# EAGLE design Thermistor_readout (EAGLE 7.7.0)
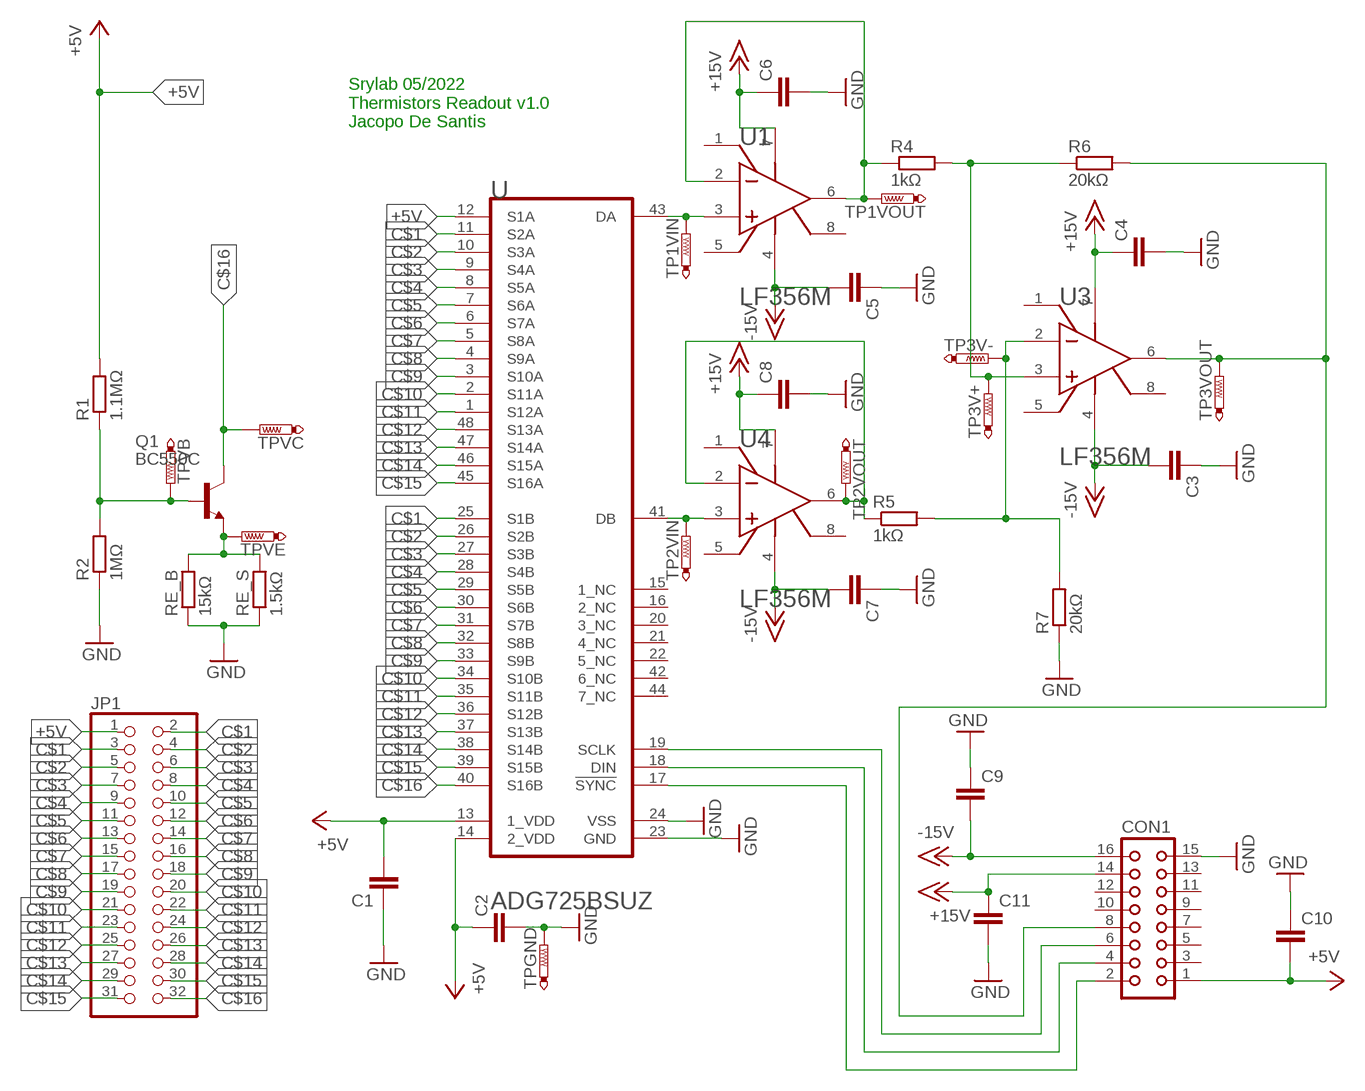
[diagram p0: schematic, sheet 1]

## Parts
C1  C-EU_SMDR1206H  [R1206H]
C2  C-EU_SMDR1206H  [R1206H]
C3  C-EU_SMDR1206H  [R1206H]
C4  C-EU_SMDR1206H  [R1206H]
C5  C-EU_SMDR1206H  [R1206H]
C6  C-EU_SMDR1206H  [R1206H]
C7  C-EU_SMDR1206H  [R1206H]
C8  C-EU_SMDR1206H  [R1206H]
C9  C-EU_SMDC1206H/D  [C1206H/D]
C10  C-EU_SMDC1206H/D  [C1206H/D]
C11  C-EU_SMDC1206H/D  [C1206H/D]
CON1  CON16L  [CON16L]
JP1  PINHD-2X16  [2X16]
Q1  BC550C  [TO92-EBC]
R1  1.1ΜΩ  R-EU_SMD0805H  [R0805H]
R2  1ΜΩ  R-EU_SMD0805H  [R0805H]
R4  1kΩ  R-EU_SMD0805H  [R0805H]
R5  1kΩ  R-EU_SMD0805H  [R0805H]
R6  20kΩ  R-EU_SMD0805H  [R0805H]
R7  20kΩ  R-EU_SMD0805H  [R0805H]
RE_B  15kΩ  R-EU_SMD1206H  [R1206H]
RE_S  1.5kΩ  R-EU_SMD0805H  [R0805H]
TP1VIN  PTR1TP20R  [TP20R]
TP1VOUT  PTR1TP20R  [TP20R]
TP2VIN  PTR1TP20R  [TP20R]
TP2VOUT  PTR1TP20R  [TP20R]
TP3V+  PTR1TP20R  [TP20R]
TP3V-  PTR1TP20R  [TP20R]
TP3VOUT  PTR1TP20R  [TP20R]
TPGND  PTR1TP20R  [TP20R]
TPVB  PTR1TP20R  [TP20R]
TPVC  PTR1TP20R  [TP20R]
TPVE  PTR1TP20R  [TP20R]
U  ANALOG_DEVICES_ADG725BSUZANALOG_DEVICES_ADG725BSUZ_0_2  [ANALOG_DEVICES_ADG725BSUZ_2]
U1  TI_NATIONAL_SEMICONDUCTOR_LF356MTI_NATIONAL_SEMICONDUCTOR_LF356M_0_2  [TI_NATIONAL_SEMICONDUCTOR_LF356M_2]
U3  TI_NATIONAL_SEMICONDUCTOR_LF356MTI_NATIONAL_SEMICONDUCTOR_LF356M_0_2  [TI_NATIONAL_SEMICONDUCTOR_LF356M_2]
U4  TI_NATIONAL_SEMICONDUCTOR_LF356MTI_NATIONAL_SEMICONDUCTOR_LF356M_0_2  [TI_NATIONAL_SEMICONDUCTOR_LF356M_2]

## Nets
+5V: C1.2 C2.1 C10.2 CON1.1 JP1.1 R1.2 U.12(S1A) U.13(1_VDD) U.14(2_VDD)
+15V: C4.1 C6.1 C8.1 C11.1 CON1.14 U1.7(V+) U3.7(V+) U4.7(V+)
-15V: C3.2 C5.2 C7.2 C9.2 CON1.16 U1.4(V-) U3.4(V-) U4.4(V-)
C$1: JP1.2 JP1.3 U.11(S2A) U.25(S1B)
C$2: JP1.4 JP1.5 U.10(S3A) U.26(S2B)
C$3: JP1.6 JP1.7 U.9(S4A) U.27(S3B)
C$4: JP1.8 JP1.9 U.8(S5A) U.28(S4B)
C$5: JP1.10 JP1.11 U.7(S6A) U.29(S5B)
C$6: JP1.12 JP1.13 U.6(S7A) U.30(S6B)
C$7: JP1.14 JP1.15 U.5(S8A) U.31(S7B)
C$8: JP1.16 JP1.17 U.4(S9A) U.32(S8B)
C$9: JP1.18 JP1.19 U.3(S10A) U.33(S9B)
C$10: JP1.20 JP1.21 U.2(S11A) U.34(S10B)
C$11: JP1.22 JP1.23 U.1(S12A) U.35(S11B)
C$12: JP1.24 JP1.25 U.36(S12B) U.48(S13A)
C$13: JP1.26 JP1.27 U.37(S13B) U.47(S14A)
C$14: JP1.28 JP1.29 U.38(S14B) U.46(S15A)
C$15: JP1.30 JP1.31 U.39(S15B) U.45(S16A)
C$16: JP1.32 Q1.C TPVC.TP U.40(S16B)
GND: C1.1 C2.2 C3.1 C4.2 C5.1 C6.2 C7.1 C8.2 C9.1 C10.1 C11.2 CON1.15 R2.1 R7.1 RE_B.1 RE_S.1 TPGND.TP U.23(GND) U.24(VSS)
N$1: Q1.B R1.1 R2.2 TPVB.TP
N$2: Q1.E RE_B.2 RE_S.2 TPVE.TP
N$3: TP2VIN.TP U4.3(IN+) U.41(DB)
N$4: R4.1 TP1VOUT.TP U1.2(IN-) U1.6(OUT)
N$5: R5.2 R7.2 TP3V-.TP U3.2(IN-)
N$6: R4.2 R6.1 TP3V+.TP U3.3(IN+)
N$7: TP1VIN.TP U1.3(IN+) U.43(DA)
N$8: R5.1 TP2VOUT.TP U4.2(IN-) U4.6(OUT)
N$11: CON1.6 U.19(SCLK)
N$13: CON1.2 U.17(!SYNC!)
N$14: CON1.4 U.18(DIN)
N$24: CON1.8 R6.2 TP3VOUT.TP U3.6(OUT)
Unconnected: CON1.3 CON1.5 CON1.7 CON1.9 CON1.10 CON1.11 CON1.12 CON1.13 U1.1(1_BAL) U1.5(2_BAL) U1.8(NC) U3.1(1_BAL) U3.5(2_BAL) U3.8(NC) U4.1(1_BAL) U4.5(2_BAL) U4.8(NC) U.15(1_NC) U.16(2_NC) U.20(3_NC) U.21(4_NC) U.22(5_NC) U.42(6_NC) U.44(7_NC)

## Notes on the sheet
- Srylab 05/2022
  Thermistors Readout v1.0
  Jacopo De Santis

## Library data of the parts
C1-C11 = 1AKarstenLib:C-EU_SMD: Capacitor, SMD only European Symbol Copied/Created July 2012 by K.F. Changed September 2016 by K.F.
CON1 = con-harting:CON16L: CONNECTOR; OC_FARNELL: unknown; OC_NEWARK: unknown
JP1 = pinhead:PINHD-2X16: PIN HEADER
Q1 = transistor-npn:BC550*: NPN Transistor
R1 R2 R4-R7 RE_B RE_S = 1AKarstenLib:R-EU_SMD: Resistor, SMD only European Symbol Copied/Created July 2012 by K.F.
TP1VIN TP1VOUT TP2VIN TP2VOUT TP3V+ TP3V- TP3VOUT TPGND TPVB TPVC TPVE = testpad:PTR1: TEST PIN
U = Analog Devices - ADG725BSUZ:ANALOG_DEVICES_ADG725BSUZ: ADI-ADG725-SU-48; BANDWIDTH_HZ: 34M; CIIVA_IDS: 987218; CODE__JEDEC: MS-026ABC; COMPONENT_LINK_1_DESCRIPTION: Manufacturer URL; COMPONENT_LINK_1_URL: http://www.analog.com/en/index.html; COMPONENT_LINK_3_DESCRIPTION: Package Specification; COMPONENT_LINK_3_URL: http://www.analog.com/static/imported-files/packages/470644706845302410119987SU48_7x7.pdf; DATASHEET: http://www.analog.com/static/imported-files/data_sheets/ADG725_731.pdf; DATASHEET_VERSION: Rev. A; FOOTPRINT_VARIANT_NAME_0: Level C; FOOTPRINT_VARIANT_NAME_1: Level B; FOOTPRINT_VARIANT_NAME_2: Level A; IMPORTED: yes; IMPORTED_FROM: vault; IMPORT_TS: 1521844804; MAX_ANALOG_SIGNAL_RANGE: Vss to Vdd; MF: Analog Devices; MOUNTING_TECHNOLOGY: Surface Mount; MPN: ADG725BSUZ; PACKAGE: SU-48; PACKAGE_DESCRIPTION: 48-Pin Thin Plastic Quad Flat Package, Body 7 x 7 mm, Pitch 0.5 mm; PACKING: Tray; PIN_0_0_18_INSIDE_EDGE: clock; PREFIX: U; RELEASE_DATE: 1391107388; RON_OHMS: 4; SUPPLY_V_GUAR_PERFORMANCE: Dual_(+/-2.5V), Single_(+3V), Single_(+5V); T_TRANSITION_S: 42n; VAULT_GUID: 7876A2FD-0DAB-484C-9F25-628C39C8E5EF; VAULT_REVISION: 63445D66-2062-4CF5-BB4E-A8A3DC790AA5
U1 U3 U4 = TI National Semiconductor - LF356M:TI_NATIONAL_SEMICONDUCTOR_LF356M: AMP-OPA-LF156-8; CIIVA_IDS: 1155468; CODE__IPC: SOIC127P600-8; COMPONENT_LINK_1_DESCRIPTION: Datasheet URL; COMPONENT_LINK_1_URL: http://www.ti.com/general/docs/lit/getliterature.tsp?genericPartNumber=LF356&fileType=pdf; COMP_TYPE: Amplifiers; FOOTPRINT_VARIANT_NAME_0: Level C; FOOTPRINT_VARIANT_NAME_1: Level B; FOOTPRINT_VARIANT_NAME_2: Level A; IMPORTED: yes; IMPORTED_FROM: vault; IMPORT_TS: 1521860174; MF: TI National Semiconductor; MPN: LF356M; PACKAGE: MS-012-AA; PACKAGE_DESCRIPTION: SOIC Narrow, 4.9 x 3.9 x 1.45mm, 8 Lead, 1.27mm Pitch; PACKAGE_REFERENCE: D0008A; PACKAGE_TOP_MARKING: NSZXTT*LF356*M; PIN_COUNT: 8; POWER_WISE: N; PREFIX: U; RELEASE_DATE: 1464069130; ROHS: No; VAULT_GUID: 86B7F69C-A366-49BF-B4AD-C30E98E1479F; VAULT_REVISION: A60BF842-290F-4FCB-8715-8B69B821FA46

## Board
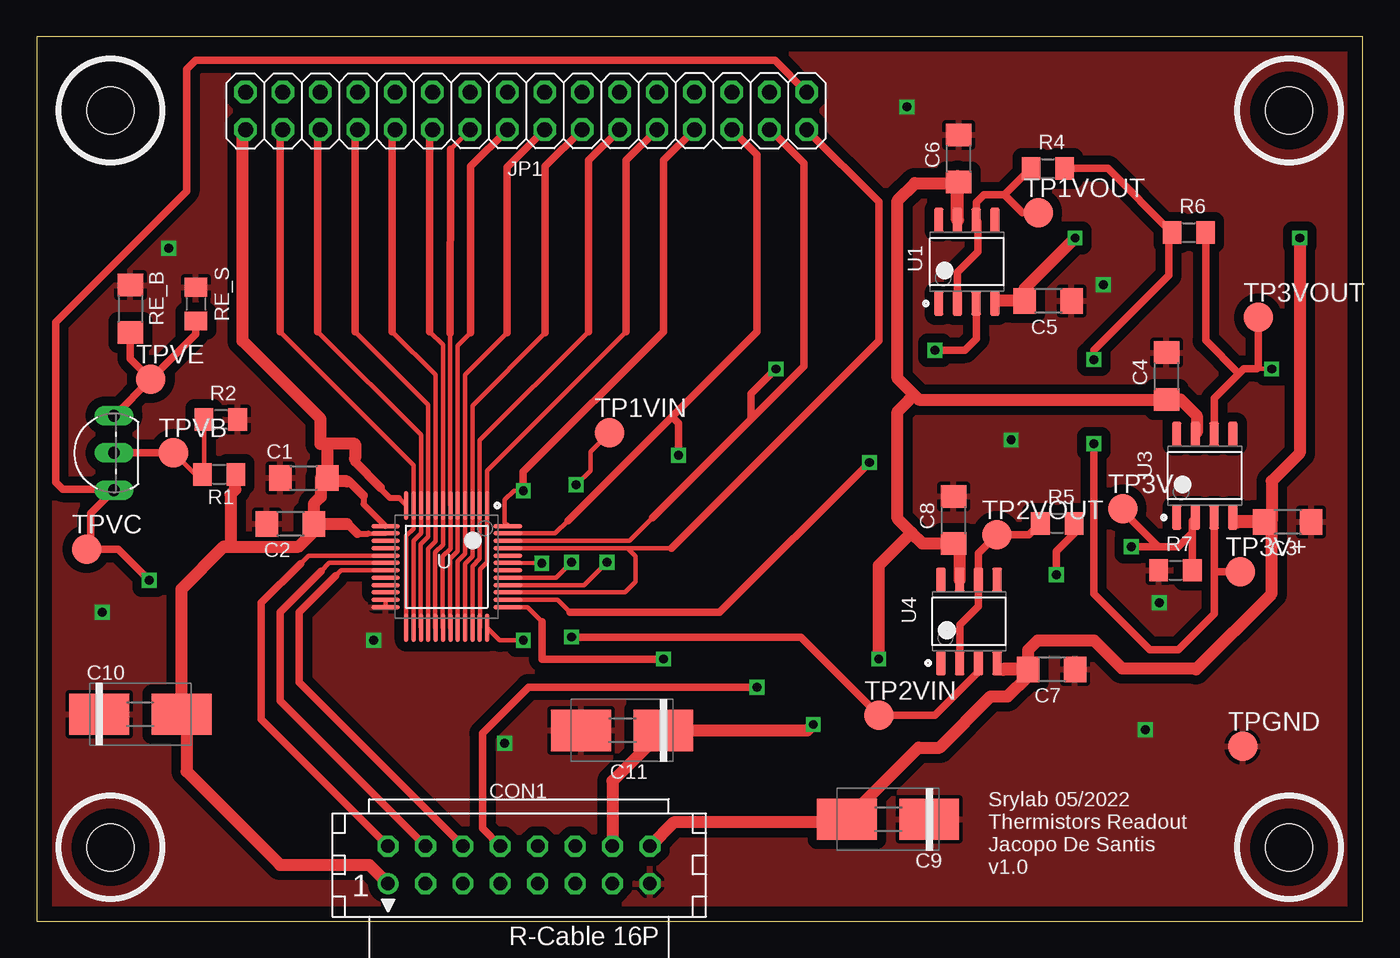
[diagram p1: board, top side]
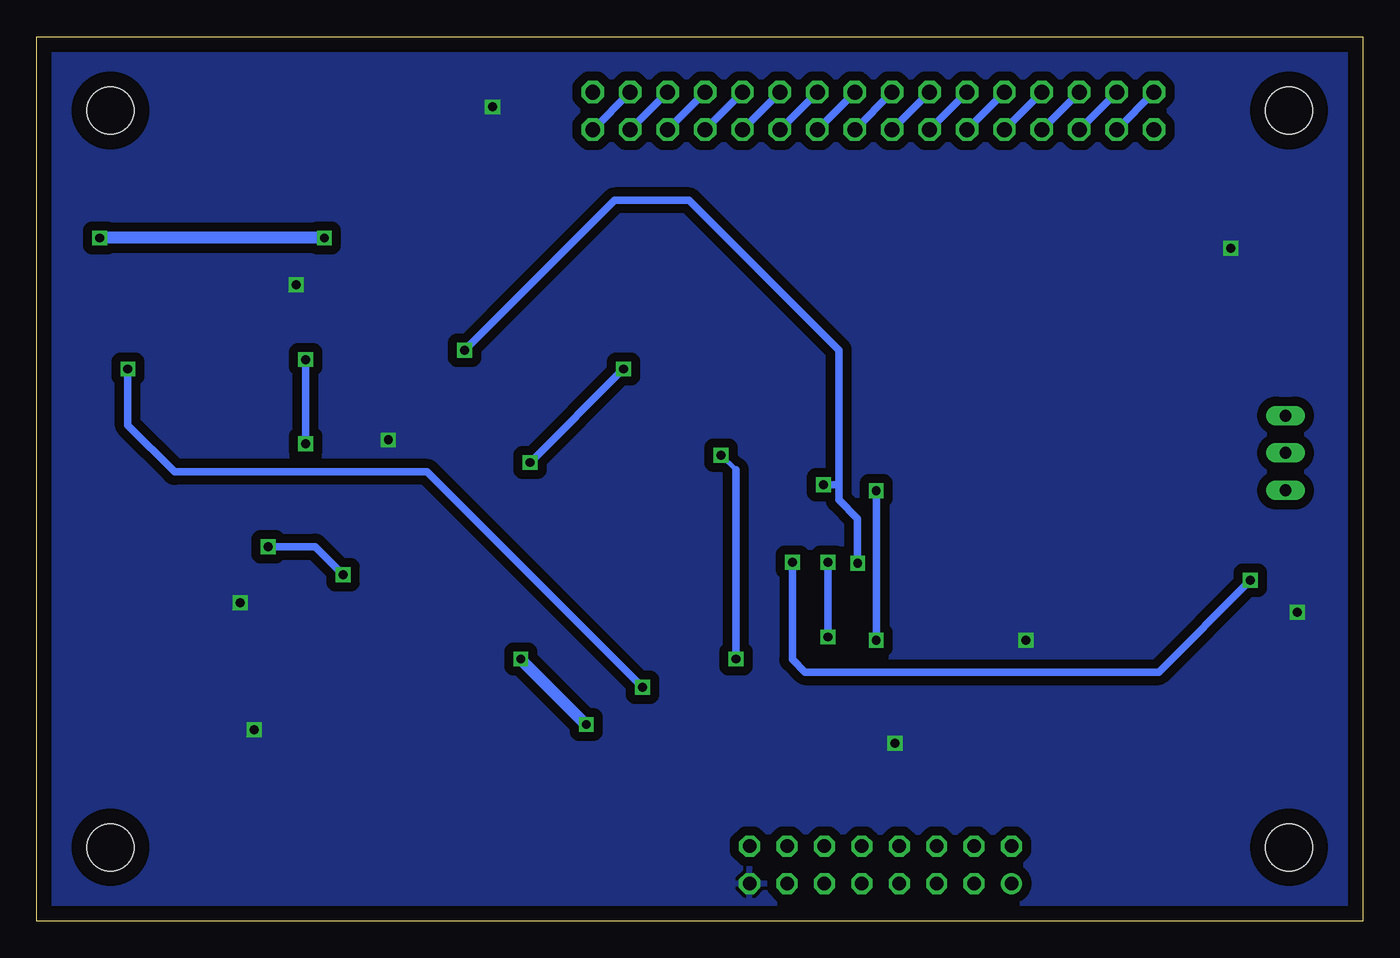
[diagram p2: board, bottom side, seen from below]

Size 90 x 60 mm. Coordinates in mm from the lower left corner, seen from the top.
Outline: 0,0 90,0 90,60 0,60 0,0
Copper layers (1*16): Top 0.035mm / dielectric 1.5mm / Bottom 0.035mm
Design rules "default *": minimum track width 10mil, minimum drill 10mil, track to track 6mil, track to pad 6mil, pad to pad 6mil, via to via 6mil, smd to smd 6mil, copper to edge 40mil, drill to drill 8mil, minimum pad ring 10mil, minimum via ring 8mil, stop-mask expansion 4mil, vias tented up to drill 0mil, thermal gap 10mil
Holes 3.2 mm at 5,55 5,5 85,5 85,55

### Footprints (pad centres in the part's own frame; a part is rotated, then mirrored left to right if it is on the bottom)
R1206H = smd 1.524 x 1.727: 1 -1.6,0; 2 1.6,0
C1206H/D = smd 4.064 x 2.794: 1 -2.794,0; 2 2.794,0
CON16L = drill 0.914: 1 8.89,1.27 | drill 0.914 octagon: 2 8.89,-1.27; 3 6.35,1.27; 4 6.35,-1.27; 5 3.81,1.27; 6 3.81,-1.27; 7 1.27,1.27; 8 1.27,-1.27; 9 -1.27,1.27; 10 -1.27,-1.27; 11 -3.81,1.27; 12 -3.81,-1.27; 13 -6.35,1.27; 14 -6.35,-1.27; 15 -8.89,1.27; 16 -8.89,-1.27
2X16 = drill 1.016 octagon: 1 -19.05,-1.27; 2 -19.05,1.27; 3 -16.51,-1.27; 4 -16.51,1.27; 5 -13.97,-1.27; 6 -13.97,1.27; 7 -11.43,-1.27; 8 -11.43,1.27; 9 -8.89,-1.27; 10 -8.89,1.27; 11 -6.35,-1.27; 12 -6.35,1.27; 13 -3.81,-1.27; 14 -3.81,1.27; 15 -1.27,-1.27; 16 -1.27,1.27; 17 1.27,-1.27; 18 1.27,1.27; 19 3.81,-1.27; 20 3.81,1.27; 21 6.35,-1.27; 22 6.35,1.27; 23 8.89,-1.27; 24 8.89,1.27; 25 11.43,-1.27; 26 11.43,1.27; 27 13.97,-1.27; 28 13.97,1.27; 29 16.51,-1.27; 30 16.51,1.27; 31 19.05,-1.27; 32 19.05,1.27
TO92-EBC = drill 0.813 long: B 0,-1.27; C -2.54,-1.27; E 2.54,-1.27
R0805H = smd 1.27 x 1.524: 1 -1.143,0; 2 1.143,0
TP20R = smd 2 x 2: TP 0,0
ANALOG_DEVICES_ADG725BSUZ_2 = smd 1.95 x 0.3: 1 -4.15,2.75; 2 -4.15,2.25; 3 -4.15,1.75; 4 -4.15,1.25; 5 -4.15,0.75; 6 -4.15,0.25; 7 -4.15,-0.25; 8 -4.15,-0.75; 9 -4.15,-1.25; 10 -4.15,-1.75; 11 -4.15,-2.25; 12 -4.15,-2.75; 25 4.15,-2.75; 26 4.15,-2.25; 27 4.15,-1.75; 28 4.15,-1.25; 29 4.15,-0.75; 30 4.15,-0.25; 31 4.15,0.25; 32 4.15,0.75; 33 4.15,1.25; 34 4.15,1.75; 35 4.15,2.25; 36 4.15,2.75 | smd 0.3 x 1.95: 13 -2.75,-4.15; 14 -2.25,-4.15; 15 -1.75,-4.15; 16 -1.25,-4.15; 17 -0.75,-4.15; 18 -0.25,-4.15; 19 0.25,-4.15; 20 0.75,-4.15; 21 1.25,-4.15; 22 1.75,-4.15; 23 2.25,-4.15; 24 2.75,-4.15; 37 2.75,4.15; 38 2.25,4.15; 39 1.75,4.15; 40 1.25,4.15; 41 0.75,4.15; 42 0.25,4.15; 43 -0.25,4.15; 44 -0.75,4.15; 45 -1.25,4.15; 46 -1.75,4.15; 47 -2.25,4.15; 48 -2.75,4.15
TI_NATIONAL_SEMICONDUCTOR_LF356M_2 = smd 1.65 x 0.65: 1 -2.825,1.905; 2 -2.825,0.635; 3 -2.825,-0.635; 4 -2.825,-1.905; 5 2.825,-1.905; 6 2.825,-0.635; 7 2.825,0.635; 8 2.825,1.905

### Placement (x,y rotation side)
C1  18.12,30.07 0 top
C2  17.22,26.95 180 top
C3  84.9,27.08 180 top
C4  76.67,36.98 90 top
C5  68.64,42.08 180 top
C6  62.58,51.74 90 top
C7  68.88,17.08 180 top
C8  62.23,27.22 90 top
C9  57.78,6.9 180 top
C10  7.03,14.04 0 top
C11  39.73,12.94 180 top
CON1  32.73,3.81 180 top
JP1  33.21,54.98 0 top
Q1  3.97,31.76 90 top
R1  12.38,30.32 0 top
R2  12.49,34.02 180 top
R4  68.63,51.07 0 top
R5  69.27,26.99 0 top
R6  78.2,46.72 0 top
R7  77.29,23.8 0 top
RE_B  6.35,41.55 270 top
RE_S  10.79,41.87 270 top
TP1VIN  38.87,33.14 0 top
TP1VOUT  67.98,48.06 0 top
TP2VIN  57.18,13.95 0 top
TP2VOUT  65.16,26.21 0 top
TP3V+  81.69,23.71 0 top
TP3V-  73.71,27.98 0 top
TP3VOUT  82.9,40.97 0 top
TPGND  81.85,11.85 0 top
TPVB  9.27,31.77 0 top
TPVC  3.39,25.24 0 top
TPVE  7.74,36.77 0 top
U  27.82,24.05 270 top
U1  63.13,44.74 90 top
U3  79.28,30.22 90 top
U4  63.28,20.33 90 top

### Tracks (layer width: path | path; a pad name or v marks a point on that pad's centre or on a via)
+5V
  Top 0.254: 10.16,13.7 C10.2 | 18.41,26.89 C2.1 | U.13 23.36,26.8 | 18.79,27.38 C2.1 | R1.2 13.97,29.86 | 19.26,32.38 19.72,31.93 | 18.82,26.44 C2.1
  Top 0.305: 13.97,53.52 JP1.1 | 22.5,26.29 U.14 | 24.56,28.71 U.12
  Top 0.406: 23.31,29.43 23.31,29.36 23.95,28.71 24.56,28.71 | 22.18,28.87 22.18,28.29 U.13 | 21.77,26.29 22.5,26.29
  Top 0.61: 21.59,31.39 21.59,31.15 23.31,29.43 | 21.05,29.84 21.21,29.84 22.18,28.87 | 21.05,26.93 21.13,26.93 21.77,26.29
  Top 0.813: 18.79,27.38 18.79,28.31 19.27,28.79 19.27,30.08 C1.2 19.72,31.93 | 13.97,53.52 13.97,39.37 19.26,34.08 19.26,32.38 21.59,32.38 21.59,31.39 | C10.2 9.82,22.52 12.7,25.4 13.23,25.4 17.78,25.4 18.82,26.44 | 10.16,13.7 10.16,10.16 16.51,3.81 22.57,3.81 CON1.1 | 21.05,29.84 19.95,29.84 | 13.14,25.48 13.14,28.95 13.47,29.27 13.47,30.27 | C2.1 21.03,26.95 21.05,26.93
  Top 0.889: 19.95,29.84 C1.2 | 13.14,25.48 13.23,25.4 | 13.47,30.27 R1.2
+15V  (via drill 0.6)
  Top 0.254: 78.58,33.11 U3.7 78.74,33.14 | 77.19,35.84 C4.1 77.65,35.38 | 59.23,35.38 59.87,35.38 | 62.52,50.08 C6.1
  Top 0.813: 62.49,50.51 C6.1 | 59.37,26.35 58.42,27.3 58.42,34.57 59.23,35.38 | v52.7,13.34 52.3,12.94 C11.1 39.08,9.49 CON1.14 | v57.15,17.78 57.15,24.13 59.37,26.35 | 78.74,33.14 78.74,34.29 77.65,35.38 | 59.37,26.35 60.1,25.62 C8.1 62.65,25.2 U4.7 | C4.1 59.87,35.38 58.42,36.83 58.42,48.9 59.6,50.08 62.52,50.08
  Top 0.889: U1.7 62.49,50.51
  Bottom 0.813: v52.7,13.34 v57.15,17.78
-15V  (via drill 0.6)
  Top 0.254: 54.78,6.69 C9.2 | 65.2,42.08 U1.4 | 65.61,17.08 U4.4 | 83.82,27.02 C3.2 83.82,27.14 | 81.5,27.08 U3.4 | 78.61,17.14 78.67,17.08 | 67.28,16.62 C7.2
  Top 0.813: 65.2,42.08 C5.2 67.04,42.91 v70.48,46.35 | 78.67,17.08 83.82,22.23 83.82,27.02 | v85.72,46.35 85.72,31.75 83.82,29.84 83.82,27.14 | 78.61,17.14 73.66,17.14 71.75,19.05 67.94,19.05 67.28,18.39 C7.2 | 54.78,6.69 43.23,6.69 CON1.16 | 67.28,16.62 65.9,15.24 64.76,15.24 61.29,11.77 59.86,11.77 C9.2
  Top 0.889: C7.2 65.61,17.08 | C3.2 81.5,27.08
  Bottom 0.813: v70.48,46.35 v85.72,46.35
C$1
  Top 0.254: U.11 | 25.08,20.48 25.07,20.47 U.25
  Top 0.305: U.11 25.56,26.61 25.08,26.13 25.08,20.48 | 16.51,53.52 JP1.3 | 16.51,40.01 25.57,30.95 U.11
  Top 0.508: 16.51,40.01 16.51,53.52
  Bottom 0.508: JP1.2 JP1.3
C$2
  Top 0.254: U.26
  Top 0.305: U.26 25.56,25.81 26.07,26.31 U.10 26.07,32.98 19.05,40.01 | 19.05,53.52 JP1.5
  Top 0.508: 19.05,40.01 19.05,53.52
  Bottom 0.508: JP1.4 JP1.5
C$3
  Top 0.254: U.27 26.05,19.92
  Top 0.305: 26.05,19.92 26.05,25.56 26.57,26.09 U.9 26.57,35.02 21.59,40.01 | 21.59,53.52 JP1.7
  Top 0.508: 21.59,40.01 21.59,53.52
  Bottom 0.508: JP1.6 JP1.7
C$4
  Top 0.305: 24.13,40.01 27.07,37.06 U.8 27.07,25.78 26.57,25.28 U.28 | 24.13,53.52 JP1.9
  Top 0.508: 24.13,40.01 24.13,53.52
  Bottom 0.508: JP1.8 JP1.9
C$5
  Top 0.305: 26.67,40.01 27.57,39.1 U.7 27.57,25.54 27.05,25.02 27.05,19.92 U.29 | 26.67,53.52 JP1.11
  Top 0.508: 26.67,40.01 26.67,53.52
  Bottom 0.508: JP1.10 JP1.11
C$6
  Top 0.305: 28.07,39.88 U.6 28.07,25.28 27.56,24.77 27.56,19.91 U.30 | 28.07,52.38 JP1.13
  Top 0.508: 28.07,39.88 28.07,52.38
  Bottom 0.508: JP1.12 JP1.13
C$7
  Top 0.305: 29.43,39.92 28.57,39.05 U.5 28.57,25.09 28.07,24.59 U.31
  Top 0.508: 29.43,39.92 29.43,51.2 JP1.15
  Bottom 0.508: JP1.14 JP1.15
C$8
  Top 0.305: U.32 28.57,24.41 29.07,24.91 U.4 29.07,37.05 31.93,39.92
  Top 0.508: 31.93,39.92 31.93,51.16 JP1.17
  Bottom 0.508: JP1.16 JP1.17
C$9
  Top 0.305: 34.52,39.92 29.57,34.97 U.3 29.57,24.74 29.08,24.26 29.08,19.91 U.33
  Top 0.508: 34.52,39.92 34.52,51.21 JP1.19
  Bottom 0.508: JP1.18 JP1.19
C$10
  Top 0.305: 37.47,40.01 30.07,32.61 U.2 30.07,24.59 29.57,24.09 U.34
  Top 0.508: 37.47,40.01 37.47,51.62 JP1.21
  Bottom 0.508: JP1.20 JP1.21
C$11
  Top 0.254: 30.08,19.91 U.35
  Top 0.305: 40.01,40.01 30.57,30.57 U.1 30.57,24.36 30.08,23.87 30.08,19.91
  Top 0.508: 40.01,40.01 40.01,51.62 JP1.23
  Bottom 0.508: JP1.22 JP1.23
C$12  (via drill 0.6)
  Top 0.305: 31.97,26.89 U.48 31.75,27.02 31.75,28.57 32.38,29.21 v33.02,29.21 | v33.02,19.05 31.42,19.05 U.36
  Top 0.508: v33.02,29.21 33.02,30.48 42.55,40.01 42.55,51.62 JP1.25
  Bottom 0.508: JP1.24 JP1.25 | v33.02,29.21 v33.02,19.05
C$13  (via drill 0.6)
  Top 0.305: U.47 35.19,26.3 36.07,27.18 | U.37 33.31,21.3 34.29,20.32
  Top 0.508: 36.07,27.18 43.11,34.22 | 43.11,34.22 48.9,40.01 48.9,51.99 JP1.27 | 34.29,20.32 34.29,17.78 v42.55,17.78 | v43.55,31.61 43.55,33.79 43.11,34.22
  Bottom 0.305: 42.55,30.61 v43.55,31.61
  Bottom 0.508: JP1.26 JP1.27 | v42.55,17.78 42.55,30.61
C$14  (via drill 0.6)
  Top 0.254: U.46 | 49.8,53.71 JP1.29
  Top 0.305: U.46 40.24,25.81 41.81,27.37 | U.38 35.35,21.8 36.2,20.95
  Top 0.508: 41.81,27.37 41.81,27.38 48.49,34.06 | 49.8,53.71 52.07,51.44 52.07,42.5 52.07,40.64 52.07,37.63 48.49,34.06 | 36.2,20.95 46.35,20.95 v56.52,31.11 | v50.16,37.47 48.49,35.79 48.49,34.06
  Bottom 0.508: JP1.28 JP1.29 | v56.52,31.11 v50.16,37.47
C$15
  Top 0.305: U.45 40.1,25.3 | 40.1,25.3 40.64,24.77 40.64,23.01 39.93,22.3 U.39 | 40.1,25.3 43.08,25.3
  Top 0.508: 43.08,25.3 57.15,39.37 57.15,48.82 JP1.31
  Bottom 0.508: JP1.30 JP1.31
C$16  (via drill 0.6)
  Top 0.305: U.40 37.16,22.8 v38.71,24.36 | TPVC.TP 3.67,25.24 | 5.15,29.3 Q1.C
  Top 0.508: JP1.32 50.09,58.42 10.79,58.42 10.16,57.78 10.16,49.53 1.27,40.64 1.27,29.78 1.74,29.3 5.15,29.3 | v7.62,23.13 5.51,25.24 3.67,25.24 3.67,27.66 Q1.C
  Bottom 0.508: v38.71,24.36 38.71,17.75 37.85,16.89 13.84,16.89 7.62,23.11 v7.62,23.13
GND  (via drill 0.6)
  Top 0.305: U.23 U.24
  other vias: 8.95,45.66 22.86,19.05 59.05,55.24 72.39,43.18 76.2,21.59 31.75,12.06 4.45,20.95 66.14,32.65 75.25,12.97
  pour Top (isolate 0.635): -4.45,62.87 93.34,62.87 93.34,-3.81 -4.45,-3.81
  pour Bottom (isolate 0.635): -1.91,61.59 91.44,61.59 91.44,-2.54 -1.91,-2.54 -1.91,60.96
N$1
  Top 0.254: 11.35,30.43 R1.1
  Top 0.305: R2.2 11.35,30.43 | R1.1 10.73,30.32 TPVB.TP | 5.25,31.77 Q1.B
  Top 0.508: TPVB.TP 5.25,31.77
N$2
  Top 0.305: TPVE.TP | Q1.E 5.27,34.3
  Top 0.508: RE_B.2 6.35,38.17 TPVE.TP | RE_S.2 10.79,39.83 TPVE.TP | 5.27,34.3 TPVE.TP
N$3  (via drill 0.6)
  Top 0.254: 63.95,16.93 63.95,17.47 U4.3
  Top 0.305: U.41 35.23,23.3 v36.29,24.36
  Top 0.508: v36.29,19.27 51.85,19.27 TP2VIN.TP 60.97,13.95 63.95,16.93
  Bottom 0.508: v36.29,24.36 v36.29,19.27
N$4
  Top 0.254: 63.87,47.46 U1.6
  Top 0.305: TP1VOUT.TP 66.9,48.06
  Top 0.508: U1.2 62.49,44.03 63.87,45.4 63.87,47.46 | U1.6 63.77,48.77 64.27,49.27 65.69,49.27 | 65.69,49.27 R4.1 | 66.9,48.06 65.69,49.27
N$5  (via drill 0.6)
  Top 0.254: U3.2 78.43,27.18 78.43,26.36
  Top 0.305: 69.19,23.52 v69.22,23.5 | TP3V-.TP 73.71,27.82
  Top 0.508: R7.2 78.43,27.18 | 78.43,26.36 77.47,25.4 76.13,25.4 | 76.13,25.4 v74.3,25.4 | R5.2 70.42,26.3 69.19,25.08 69.19,23.52 | 73.71,27.82 76.13,25.4
  Bottom 0.508: v74.3,25.4 71.12,25.4 v69.22,23.5
N$6  (via drill 0.6)
  Top 0.254: 76.83,46.5 R6.1
  Top 0.305: v71.75,38.1 71.75,38.73 | 80.16,23.71 79.92,23.47
  Top 0.508: R4.2 72.71,51.07 R6.1 | U3.3 79.92,23.47 79.92,20.86 77.47,18.41 75.56,18.41 71.75,22.23 v71.75,32.38 | 71.75,38.73 76.83,43.81 76.83,46.5 | TP3V+.TP 80.16,23.71
  Bottom 0.508: v71.75,32.38 v71.75,38.1
N$7  (via drill 0.6)
  Top 0.254: 63.77,41.54 U1.3
  Top 0.305: v34.27,24.27 U.43 | 63.79,41.89 U1.3 | v36.61,29.6 37.58,30.56 37.58,31.85 TP1VIN.TP
  Top 0.508: v60.96,38.73 63.01,38.73 63.79,39.52 63.79,41.89
  Bottom 0.254: v34.27,24.27 34.29,24.26
  Bottom 0.305: 35.64,29.6 35.56,29.68
  Bottom 0.508: 34.29,24.26 34.29,27.3 35.56,28.57 35.56,29.68 35.56,38.73 45.72,48.9 50.8,48.9 v60.96,38.73 | v36.61,29.6 35.64,29.6
N$8
  Top 0.508: U4.2 62.65,20.1 63.91,21.37 U4.6 63.91,24.96 TP2VOUT.TP 67.35,26.21 R5.1
N$11
  Top 0.254: U.19
  Top 0.305: U.19 20.64,23.79 20.27,23.42
  Top 0.508: 20.24,23.39 17.81,20.95 17.81,16.19 CON1.6 | 20.25,23.39 20.24,23.39 | 20.24,23.39 20.27,23.42
N$13
  Top 0.305: U.17 18.45,24.8 17.91,24.26
  Top 0.508: 17.91,24.26 15.24,21.59 15.24,13.68 CON1.2
N$14
  Top 0.305: 19.3,23.75 19.86,24.3 U.18
  Top 0.508: 19.3,23.75 16.51,20.95 16.51,14.95 CON1.4
N$24  (via drill 0.6)
  Top 0.305: v83.82,37.47 82.82,37.47 82.9,37.55
  Top 0.508: 82.82,37.47 81.92,37.47 81.6,37.15 | 81.6,37.15 79.92,35.47 U3.6 | R6.2 79.34,39.4 81.6,37.15 | v48.9,15.88 33.38,15.88 30.24,12.74 30.24,6.3 CON1.8 | TP3VOUT.TP 82.9,37.55
  Bottom 0.508: v48.9,15.88 63.5,30.48 80.64,30.48 83.82,33.66 v83.82,37.47

### Text on the board
tNames: Srylab 05/2022 / Thermistors Readout / Jacopo De Santis / v1.0